# Altium project Cell Protection Board.PrjPcb
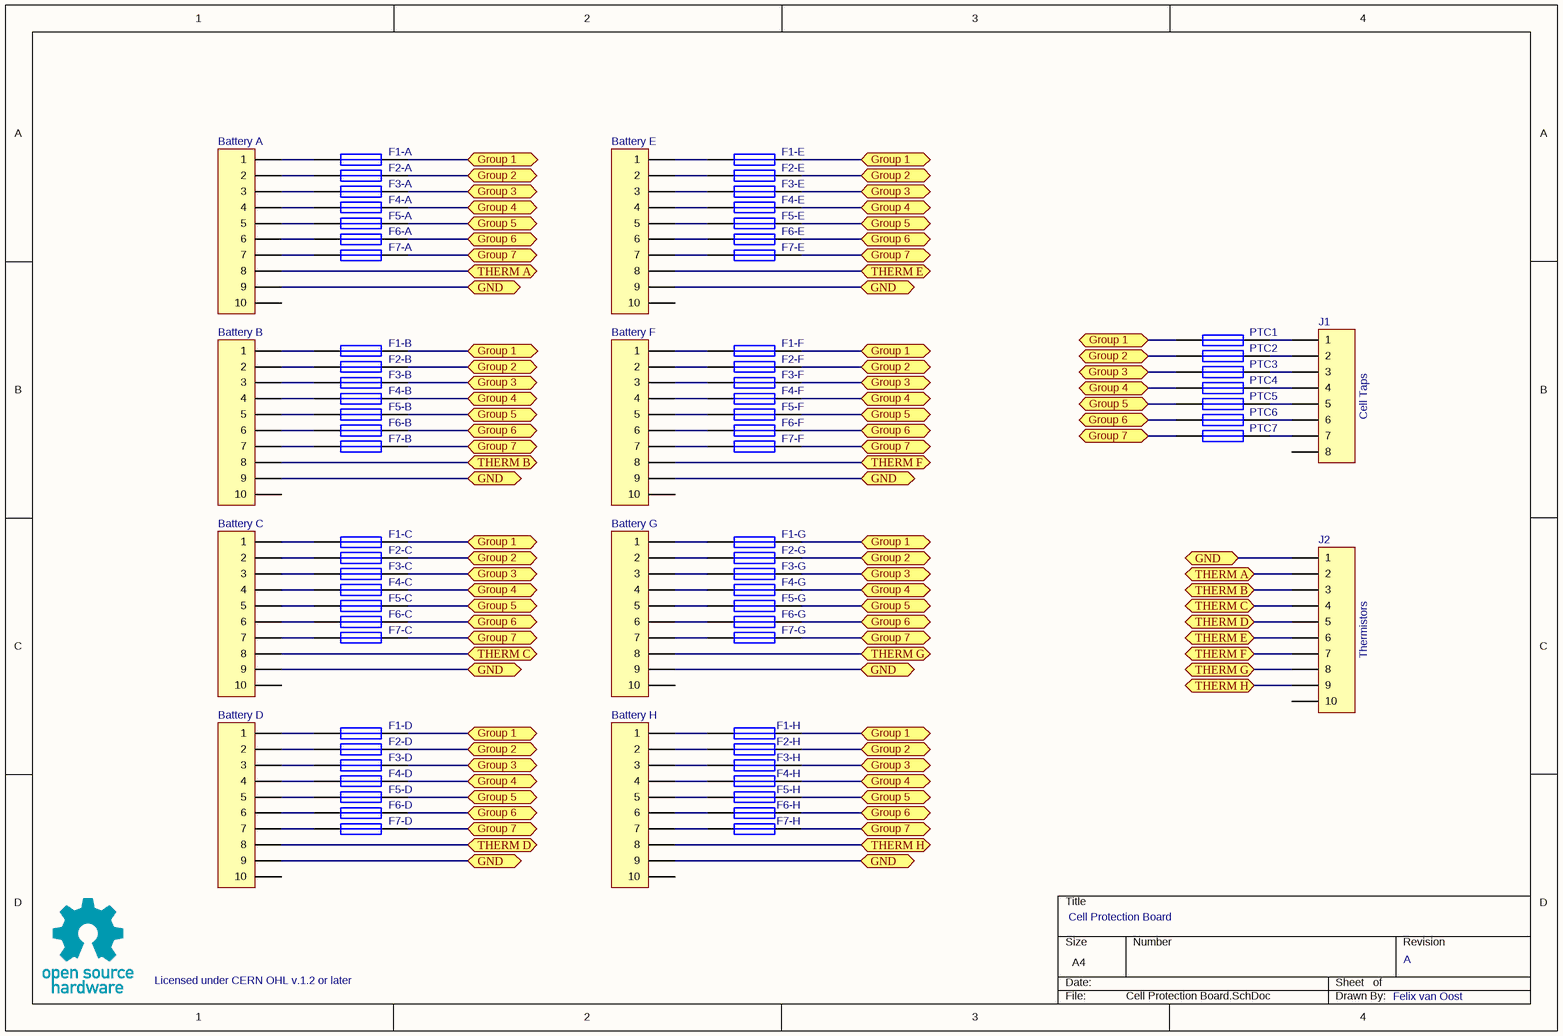
[diagram p0: Cell Protection Board.SchDoc]
1 sheet, 73 parts. Net scope: flat (ports and power ports of the same name join across sheets).
Board file: Cell Protection Board.PcbDoc

## Sheet Cell Protection Board.SchDoc: Cell Protection Board
size A4; DrawnBy: Felix van Oost; Engineer: Felix van Oost; Organization: UBC Electric Car Club; Revision: A; SheetNumber: 1; SheetTotal: 1; ProjectName: Cell Protection Board

### Parts
Battery_A  Molex Micro-Fit 43045-1000  [Molex Micro-Fit 43045-1000]  (value not drawn)
Battery_B  Molex Micro-Fit 43045-1000  [Molex Micro-Fit 43045-1000]  (value not drawn)
Battery_C  Molex Micro-Fit 43045-1000  [Molex Micro-Fit 43045-1000]  (value not drawn)
Battery_D  Molex Micro-Fit 43045-1000  [Molex Micro-Fit 43045-1000]  (value not drawn)
Battery_E  Molex Micro-Fit 43045-1000  [Molex Micro-Fit 43045-1000]  (value not drawn)
Battery_F  Molex Micro-Fit 43045-1000  [Molex Micro-Fit 43045-1000]  (value not drawn)
Battery_G  Molex Micro-Fit 43045-1000  [Molex Micro-Fit 43045-1000]  (value not drawn)
Battery_H  Molex Micro-Fit 43045-1000  [Molex Micro-Fit 43045-1000]  (value not drawn)
F1-A  (no value)  [Bel Fuse C1T Series (3216)]
F1-B  (no value)  [Bel Fuse C1T Series (3216)]
F1-C  (no value)  [Bel Fuse C1T Series (3216)]
F1-D  (no value)  [Bel Fuse C1T Series (3216)]
F1-E  (no value)  [Bel Fuse C1T Series (3216)]
F1-F  (no value)  [Bel Fuse C1T Series (3216)]
F1-G  (no value)  [Bel Fuse C1T Series (3216)]
F1-H  (no value)  [Bel Fuse C1T Series (3216)]
F2-A  (no value)  [Bel Fuse C1T Series (3216)]
F2-B  (no value)  [Bel Fuse C1T Series (3216)]
F2-C  (no value)  [Bel Fuse C1T Series (3216)]
F2-D  (no value)  [Bel Fuse C1T Series (3216)]
F2-E  (no value)  [Bel Fuse C1T Series (3216)]
F2-F  (no value)  [Bel Fuse C1T Series (3216)]
F2-G  (no value)  [Bel Fuse C1T Series (3216)]
F2-H  (no value)  [Bel Fuse C1T Series (3216)]
F3-A  (no value)  [Bel Fuse C1T Series (3216)]
F3-B  (no value)  [Bel Fuse C1T Series (3216)]
F3-C  (no value)  [Bel Fuse C1T Series (3216)]
F3-D  (no value)  [Bel Fuse C1T Series (3216)]
F3-E  (no value)  [Bel Fuse C1T Series (3216)]
F3-F  (no value)  [Bel Fuse C1T Series (3216)]
F3-G  (no value)  [Bel Fuse C1T Series (3216)]
F3-H  (no value)  [Bel Fuse C1T Series (3216)]
F4-A  (no value)  [Bel Fuse C1T Series (3216)]
F4-B  (no value)  [Bel Fuse C1T Series (3216)]
F4-C  (no value)  [Bel Fuse C1T Series (3216)]
F4-D  (no value)  [Bel Fuse C1T Series (3216)]
F4-E  (no value)  [Bel Fuse C1T Series (3216)]
F4-F  (no value)  [Bel Fuse C1T Series (3216)]
F4-G  (no value)  [Bel Fuse C1T Series (3216)]
F4-H  (no value)  [Bel Fuse C1T Series (3216)]
F5-A  (no value)  [Bel Fuse C1T Series (3216)]
F5-B  (no value)  [Bel Fuse C1T Series (3216)]
F5-C  (no value)  [Bel Fuse C1T Series (3216)]
F5-D  (no value)  [Bel Fuse C1T Series (3216)]
F5-E  (no value)  [Bel Fuse C1T Series (3216)]
F5-F  (no value)  [Bel Fuse C1T Series (3216)]
F5-G  (no value)  [Bel Fuse C1T Series (3216)]
F5-H  (no value)  [Bel Fuse C1T Series (3216)]
F6-A  (no value)  [Bel Fuse C1T Series (3216)]
F6-B  (no value)  [Bel Fuse C1T Series (3216)]
F6-C  (no value)  [Bel Fuse C1T Series (3216)]
F6-D  (no value)  [Bel Fuse C1T Series (3216)]
F6-E  (no value)  [Bel Fuse C1T Series (3216)]
F6-F  (no value)  [Bel Fuse C1T Series (3216)]
F6-G  (no value)  [Bel Fuse C1T Series (3216)]
F6-H  (no value)  [Bel Fuse C1T Series (3216)]
F7-A  (no value)  [Bel Fuse C1T Series (3216)]
F7-B  (no value)  [Bel Fuse C1T Series (3216)]
F7-C  (no value)  [Bel Fuse C1T Series (3216)]
F7-D  (no value)  [Bel Fuse C1T Series (3216)]
F7-E  (no value)  [Bel Fuse C1T Series (3216)]
F7-F  (no value)  [Bel Fuse C1T Series (3216)]
F7-G  (no value)  [Bel Fuse C1T Series (3216)]
F7-H  (no value)  [Bel Fuse C1T Series (3216)]
J1  Molex Micro-Fit 43045-0800  [Molex Micro-Fit 43045-0800]  (value not drawn)
J2  Molex Micro-Fit 43045-1000  [Molex Micro-Fit 43045-1000]  (value not drawn)
PTC1  (no value)  [Bel Fuse 0ZCJ Series (3216)]
PTC2  (no value)  [Bel Fuse 0ZCJ Series (3216)]
PTC3  (no value)  [Bel Fuse 0ZCJ Series (3216)]
PTC4  (no value)  [Bel Fuse 0ZCJ Series (3216)]
PTC5  (no value)  [Bel Fuse 0ZCJ Series (3216)]
PTC6  (no value)  [Bel Fuse 0ZCJ Series (3216)]
PTC7  (no value)  [Bel Fuse 0ZCJ Series (3216)]

### Ports
GND, Group 1, Group 2, Group 3, Group 4, Group 5, Group 6, Group 7, THERM A, THERM B, THERM C, THERM D, THERM E, THERM F, THERM G, THERM H

### Nets
NetBattery_A_1: Battery_A.1 F1-A.1
NetBattery_A_2: Battery_A.2 F2-A.1
NetBattery_A_3: Battery_A.3 F3-A.1
NetBattery_A_4: Battery_A.4 F4-A.1
NetBattery_A_5: Battery_A.5 F5-A.1
NetBattery_A_6: Battery_A.6 F6-A.1
NetBattery_A_7: Battery_A.7 F7-A.1
NetBattery_A_8: Battery_A.8 J2.2 ; port THERM A
NetBattery_A_9: Battery_A.9 Battery_B.9 Battery_C.9 Battery_D.9 Battery_E.9 Battery_F.9 Battery_G.9 Battery_H.9 J2.1 ; port GND
NetBattery_B_1: Battery_B.1 F1-B.1
NetBattery_B_2: Battery_B.2 F2-B.1
NetBattery_B_3: Battery_B.3 F3-B.1
NetBattery_B_4: Battery_B.4 F4-B.1
NetBattery_B_5: Battery_B.5 F5-B.1
NetBattery_B_6: Battery_B.6 F6-B.1
NetBattery_B_7: Battery_B.7 F7-B.1
NetBattery_B_8: Battery_B.8 J2.3 ; port THERM B
NetBattery_C_1: Battery_C.1 F1-C.1
NetBattery_C_2: Battery_C.2 F2-C.1
NetBattery_C_3: Battery_C.3 F3-C.1
NetBattery_C_4: Battery_C.4 F4-C.1
NetBattery_C_5: Battery_C.5 F5-C.1
NetBattery_C_6: Battery_C.6 F6-C.1
NetBattery_C_7: Battery_C.7 F7-C.1
NetBattery_C_8: Battery_C.8 J2.4 ; port THERM C
NetBattery_D_1: Battery_D.1 F1-D.1
NetBattery_D_2: Battery_D.2 F2-D.1
NetBattery_D_3: Battery_D.3 F3-D.1
NetBattery_D_4: Battery_D.4 F4-D.1
NetBattery_D_5: Battery_D.5 F5-D.1
NetBattery_D_6: Battery_D.6 F6-D.1
NetBattery_D_7: Battery_D.7 F7-D.1
NetBattery_D_8: Battery_D.8 J2.5 ; port THERM D
NetBattery_E_1: Battery_E.1 F1-E.1
NetBattery_E_2: Battery_E.2 F2-E.1
NetBattery_E_3: Battery_E.3 F3-E.1
NetBattery_E_4: Battery_E.4 F4-E.1
NetBattery_E_5: Battery_E.5 F5-E.1
NetBattery_E_6: Battery_E.6 F6-E.1
NetBattery_E_7: Battery_E.7 F7-E.1
NetBattery_E_8: Battery_E.8 J2.6 ; port THERM E
NetBattery_F_1: Battery_F.1 F1-F.1
NetBattery_F_2: Battery_F.2 F2-F.1
NetBattery_F_3: Battery_F.3 F3-F.1
NetBattery_F_4: Battery_F.4 F4-F.1
NetBattery_F_5: Battery_F.5 F5-F.1
NetBattery_F_6: Battery_F.6 F6-F.1
NetBattery_F_7: Battery_F.7 F7-F.1
NetBattery_F_8: Battery_F.8 J2.7 ; port THERM F
NetBattery_G_1: Battery_G.1 F1-G.1
NetBattery_G_2: Battery_G.2 F2-G.1
NetBattery_G_3: Battery_G.3 F3-G.1
NetBattery_G_4: Battery_G.4 F4-G.1
NetBattery_G_5: Battery_G.5 F5-G.1
NetBattery_G_6: Battery_G.6 F6-G.1
NetBattery_G_7: Battery_G.7 F7-G.1
NetBattery_G_8: Battery_G.8 J2.8 ; port THERM G
NetBattery_H_1: Battery_H.1 F1-H.1
NetBattery_H_2: Battery_H.2 F2-H.1
NetBattery_H_3: Battery_H.3 F3-H.1
NetBattery_H_4: Battery_H.4 F4-H.1
NetBattery_H_5: Battery_H.5 F5-H.1
NetBattery_H_6: Battery_H.6 F6-H.1
NetBattery_H_7: Battery_H.7 F7-H.1
NetBattery_H_8: Battery_H.8 J2.9 ; port THERM H
NetF1-A_2: F1-A.2 F1-B.2 F1-C.2 F1-D.2 F1-E.2 F1-F.2 F1-G.2 F1-H.2 PTC1.1 ; port Group 1
NetF2-A_2: F2-A.2 F2-B.2 F2-C.2 F2-D.2 F2-E.2 F2-F.2 F2-G.2 F2-H.2 PTC2.1 ; port Group 2
NetF3-A_2: F3-A.2 F3-B.2 F3-C.2 F3-D.2 F3-E.2 F3-F.2 F3-G.2 F3-H.2 PTC3.1 ; port Group 3
NetF4-A_2: F4-A.2 F4-B.2 F4-C.2 F4-D.2 F4-E.2 F4-F.2 F4-G.2 F4-H.2 PTC4.1 ; port Group 4
NetF5-A_2: F5-A.2 F5-B.2 F5-C.2 F5-D.2 F5-E.2 F5-F.2 F5-G.2 F5-H.2 PTC5.1 ; port Group 5
NetF6-A_2: F6-A.2 F6-B.2 F6-C.2 F6-D.2 F6-E.2 F6-F.2 F6-G.2 F6-H.2 PTC6.1 ; port Group 6
NetF7-A_2: F7-A.2 F7-B.2 F7-C.2 F7-D.2 F7-E.2 F7-F.2 F7-G.2 F7-H.2 PTC7.1 ; port Group 7
NetJ1_1: J1.1 PTC1.2
NetJ1_2: J1.2 PTC2.2
NetJ1_3: J1.3 PTC3.2
NetJ1_4: J1.4 PTC4.2
NetJ1_5: J1.5 PTC5.2
NetJ1_6: J1.6 PTC6.2
NetJ1_7: J1.7 PTC7.2

Not connected (* = marked no-connect by the designer): Battery_A 10; Battery_B 10; Battery_C 10; Battery_D 10; Battery_E 10; Battery_F 10; Battery_G 10; Battery_H 10; J1 8; J2 10

### Notes on the sheet
- (near J1) Cell Taps
- (near J2) Thermistors
- Licensed under CERN OHL v.1.2 or later

### Library data of the parts
Battery_A Battery_B Battery_C Battery_D Battery_E Battery_F Battery_G Battery_H J2 = Molex Micro-Fit 43045-1000: 10-Pin Right-Angle Locking Male Header; Digi-Key Part Number: WM1817-ND
F1-A F1-B F1-C F1-D F1-E F1-F F1-G F1-H F2-A F2-B F2-C F2-D F2-E F2-F F2-G F2-H F3-A F3-B F3-C F3-D F3-E F3-F F3-G F3-H F4-A F4-B F4-C F4-D F4-E F4-F F4-G F4-H F5-A F5-B F5-C F5-D F5-E F5-F F5-G F5-H F6-A F6-B F6-C F6-D F6-E F6-F F6-G F6-H F7-A F7-B F7-C F7-D F7-E F7-F F7-G F7-H PTC1-PTC7 = Fuse 1: Fuse; Published: 8-Jun-2000; LatestRevisionDate: 17-Jul-2002; LatestRevisionNote: Re-released for DXP Platform.; PackageReference: PIN-W2/E2.8; Publisher: Altium Limited; PackageDescription: Thru-Hole; 2 Leads
J1 = Molex Micro-Fit 43045-0800: 8-Pin Right-Angle Locking Male Header; Digi-Key Part Number: WM1816-ND